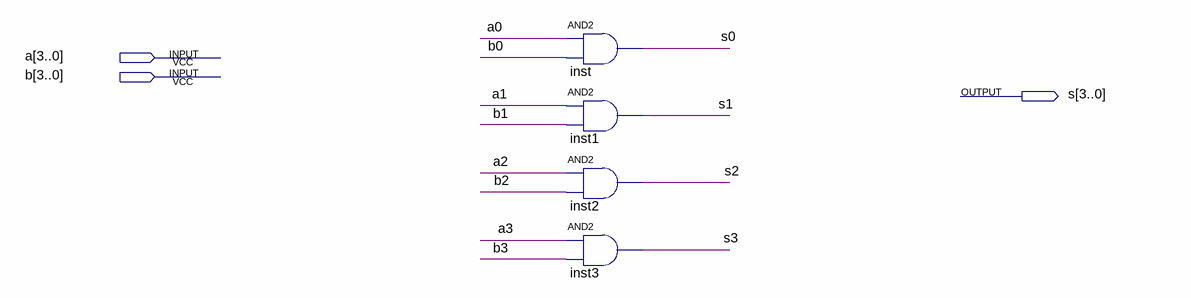
[diagram p0: schematic sheet]
// Quartus schematic and2x4.bdf as structural Verilog: 4 symbols, 3 pins
module and2x4 (
  input  [3:0] a,
  input  [3:0] b,
  output [3:0] s
);

  and inst (s[0], a[0], b[0]);
  and inst1 (s[1], a[1], b[1]);
  and inst2 (s[2], a[2], b[2]);
  and inst3 (s[3], a[3], b[3]);
endmodule
